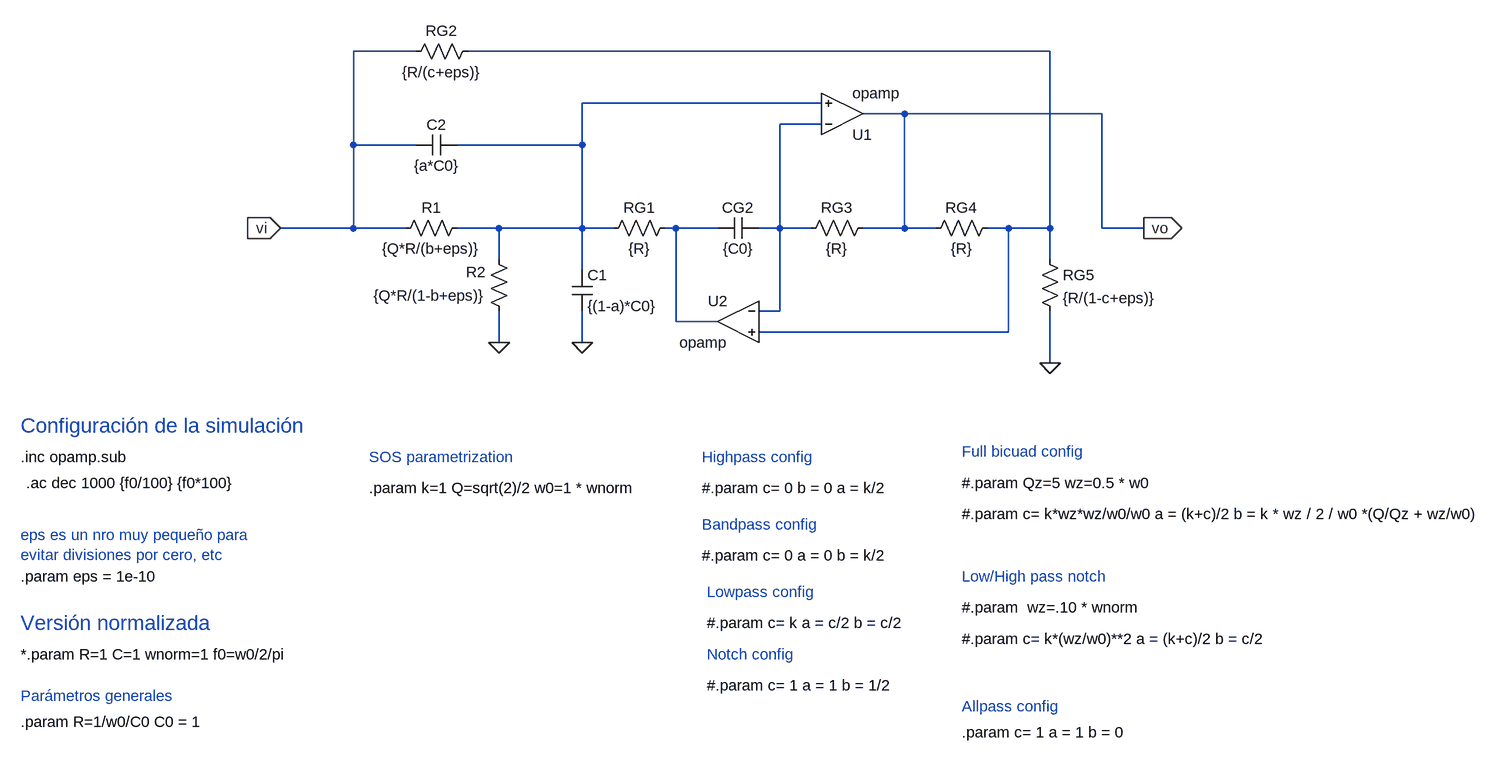
[diagram p0: schematic GIC_bicuad.asc]
GIC_bicuad.asc, the LTspice schematic file:
Version 4
SHEET 1 2616 1448
WIRE -144 -96 -240 -96
WIRE 832 -96 -64 -96
WIRE 480 -16 112 -16
WIRE 608 0 544 0
WIRE 912 0 608 0
WIRE 480 16 416 16
WIRE -240 48 -240 -96
WIRE -144 48 -240 48
WIRE 112 48 112 -16
WIRE 112 48 -80 48
WIRE -240 176 -240 48
WIRE -240 176 -352 176
WIRE -160 176 -240 176
WIRE -16 176 -80 176
WIRE 112 176 112 48
WIRE 112 176 -16 176
WIRE 160 176 112 176
WIRE 256 176 240 176
WIRE 320 176 256 176
WIRE 416 176 416 16
WIRE 416 176 384 176
WIRE 464 176 416 176
WIRE 608 176 608 0
WIRE 608 176 544 176
WIRE 656 176 608 176
WIRE 768 176 736 176
WIRE 832 176 832 -96
WIRE 832 176 768 176
WIRE 912 176 912 0
WIRE 976 176 912 176
WIRE -16 224 -16 176
WIRE 832 224 832 176
WIRE 112 240 112 176
WIRE 416 304 416 176
WIRE 416 304 384 304
WIRE 256 320 256 176
WIRE 320 320 256 320
WIRE 768 336 768 176
WIRE 768 336 384 336
WIRE -16 352 -16 304
WIRE 112 352 112 304
WIRE 832 384 832 304
FLAG 832 384 0
FLAG -352 176 vi
IOPIN -352 176 In
FLAG 976 176 vo
IOPIN 976 176 Out
FLAG 112 352 0
FLAG -16 352 0
SYMBOL res -64 160 R90
WINDOW 0 0 56 VBottom 2
WINDOW 3 32 56 VTop 2
SYMATTR InstName R1
SYMATTR Value {Q*R/(b+eps)}
SYMBOL res 144 192 R270
WINDOW 0 32 56 VTop 2
WINDOW 3 0 56 VBottom 2
SYMATTR InstName RG1
SYMATTR Value {R}
SYMBOL res 448 192 R270
WINDOW 0 32 56 VTop 2
WINDOW 3 0 56 VBottom 2
SYMATTR InstName RG3
SYMATTR Value {R}
SYMBOL res 640 192 R270
WINDOW 0 32 56 VTop 2
WINDOW 3 0 56 VBottom 2
SYMATTR InstName RG4
SYMATTR Value {R}
SYMBOL res 816 208 R0
SYMATTR InstName RG5
SYMATTR Value {R/(1-c+eps)}
SYMBOL cap 96 240 R0
SYMATTR InstName C1
SYMATTR Value {(1-a)*C0}
SYMBOL cap 320 192 R270
WINDOW 0 32 32 VTop 2
WINDOW 3 0 32 VBottom 2
SYMATTR InstName CG2
SYMATTR Value {C0}
SYMBOL OpAmps\\opamp 512 64 M180
SYMATTR InstName U1
SYMBOL OpAmps\\opamp 352 256 M0
SYMATTR InstName U2
SYMBOL res 0 320 R180
WINDOW 0 36 76 Left 2
WINDOW 3 36 40 Left 2
SYMATTR InstName R2
SYMATTR Value {Q*R/(1-b+eps)}
SYMBOL cap -80 32 R90
WINDOW 0 0 32 VBottom 2
WINDOW 3 32 32 VTop 2
SYMATTR InstName C2
SYMATTR Value {a*C0}
SYMBOL res -160 -80 R270
WINDOW 0 32 56 VTop 2
WINDOW 3 0 56 VBottom 2
SYMATTR InstName RG2
SYMATTR Value {R/(c+eps)}
TEXT -752 528 Left 2 !.inc opamp.sub
TEXT -744 568 Left 2 !.ac dec 1000 {f0/100} {f0*100}
TEXT 696 568 Left 2 !#.param Qz=5 wz=0.5 * w0
TEXT -752 784 Left 3 ;Versión normalizada
TEXT -752 832 Left 2 !*.param R=1 C=1 wnorm=1 f0=w0/2/pi
TEXT 696 520 Left 2 ;Full bicuad config
TEXT -752 936 Left 2 !.param R=1/w0/C0 C0 = 1
TEXT -752 480 Left 3 ;Configuración de la simulación
TEXT 696 616 Left 2 !#.param c= k*wz*wz/w0/w0 a = (k+c)/2 b = k * wz / 2 / w0 *(Q/Qz + wz/w0)
TEXT 696 712 Left 2 ;Low/High pass notch
TEXT 696 808 Left 2 !#.param c= k*(wz/w0)**2 a = (k+c)/2 b = c/2
TEXT 696 760 Left 2 !#.param  wz=.10 * wnorm
TEXT 296 528 Left 2 ;Highpass config
TEXT 296 576 Left 2 !#.param c= 0 b = 0 a = k/2
TEXT -216 576 Left 2 !.param k=1 Q=sqrt(2)/2 w0=1 * wnorm
TEXT 696 912 Left 2 ;Allpass config
TEXT 696 952 Left 2 !.param c= 1 a = 1 b = 0
TEXT 304 736 Left 2 ;Lowpass config
TEXT 304 784 Left 2 !#.param c= k a = c/2 b = c/2
TEXT 296 632 Left 2 ;Bandpass config
TEXT 296 680 Left 2 !#.param c= 0 a = 0 b = k/2
TEXT -752 896 Left 2 ;Parámetros generales
TEXT -752 712 Left 2 !.param eps = 1e-10
TEXT -752 648 Left 2 ;eps es un nro muy pequeño para\nevitar divisiones por cero, etc
TEXT -216 528 Left 2 ;SOS parametrization
TEXT 304 832 Left 2 ;Notch config
TEXT 304 880 Left 2 !#.param c= 1 a = 1 b = 1/2

The netlist it stands for:
* GIC_bicuad.asc
R1 N002 vi {Q*R/(b+eps)}
RG1 N002 N004 {R}
RG3 N003 vo {R}
RG4 vo N001 {R}
RG5 N001 0 {R/(1-c+eps)}
C1 N002 0 {(1-a)*C0}
CG2 N004 N003 {C0}
XU1 N003 N002 vo opamp Aol=100K GBW=10Meg  ; pins invin noninvin out
XU2 N003 N001 N004 opamp Aol=100K GBW=10Meg  ; pins invin noninvin out
R2 0 N002 {Q*R/(1-b+eps)}
C2 N002 vi {a*C0}
RG2 vi N001 {R/(c+eps)}
.inc opamp.sub
.ac dec 1000 {f0/100} {f0*100}
#.param Qz=5 wz=0.5 * w0
* Versión normalizada
*.param R=1 C=1 wnorm=1 f0=w0/2/pi
* Full bicuad config
.param R=1/w0/C0 C0 = 1
* Configuración de la simulación
#.param c= k*wz*wz/w0/w0 a = (k+c)/2 b = k * wz / 2 / w0 *(Q/Qz + wz/w0)
* Low/High pass notch
#.param c= k*(wz/w0)**2 a = (k+c)/2 b = c/2
#.param  wz=.10 * wnorm
* Highpass config
#.param c= 0 b = 0 a = k/2
.param k=1 Q=sqrt(2)/2 w0=1 * wnorm
* Allpass config
.param c= 1 a = 1 b = 0
* Lowpass config
#.param c= k a = c/2 b = c/2
* Bandpass config
#.param c= 0 a = 0 b = k/2
* Parámetros generales
.param eps = 1e-10
* eps es un nro muy pequeño para
* evitar divisiones por cero, etc
* SOS parametrization
* Notch config
#.param c= 1 a = 1 b = 1/2
.backanno
.end